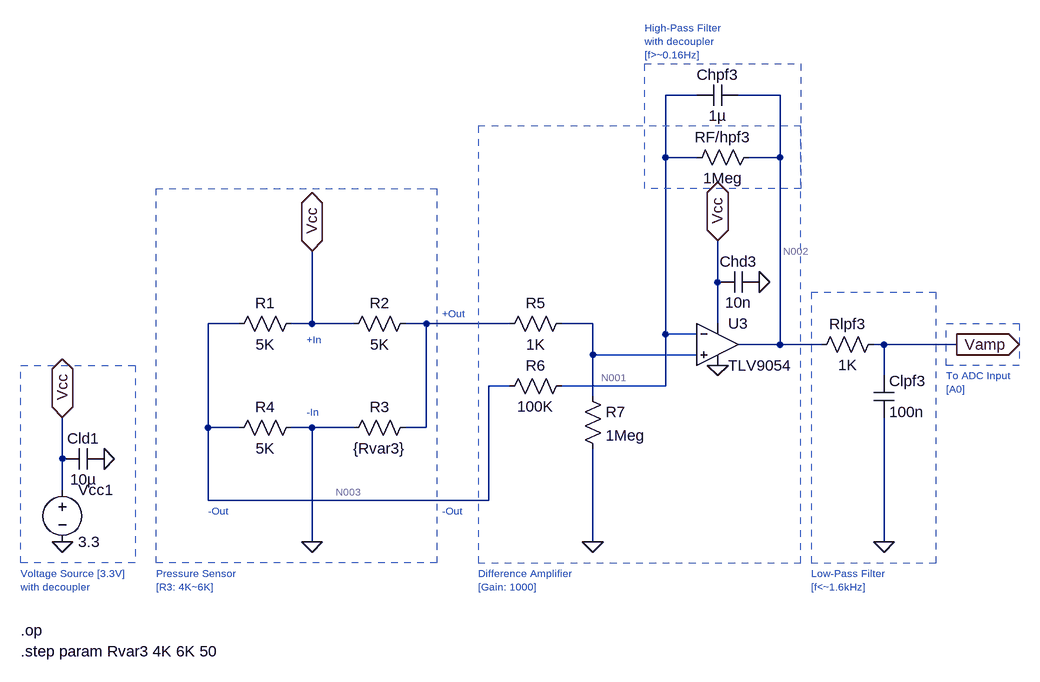
[diagram p0: schematic Project_3_PressureSensor.asc]
* Project_3_PressureSensor.asc
R1 Vcc N003 5K
R2 N004 Vcc 5K
R4 0 N003 5K
R3 N004 0 {Rvar3}
R5 N005 N004 1K
R6 N001 N003 100K
R7 N005 0 1Meg
RF/hpf3 N002 N001 1Meg
Chpf3 N002 N001 1µ
Chd3 Vcc 0 10n
* U3: TLV9054 (symbol TLV9054 not available, pins judged from their places): In+=N005 In-=N001 V+=Vcc V-=0 OUT=N002
Vcc1 Vcc 0 3.3
Cld1 0 Vcc 10µ
Rlpf3 Vamp N002 1K
Clpf3 Vamp 0 100n
* Pressure Sensor
* [R3: 4K~6K]
* Difference Amplifier
* [Gain: 1000]
* To ADC Input
* [A0]
* -Out
* -Out
* +Out
* Voltage Source [3.3V]
* with decoupler
* -In
* +In
* High-Pass Filter
* with decoupler
* [f>~0.16Hz]
.op
.step param Rvar3 4K 6K 50
* Low-Pass Filter
* [f<~1.6kHz]
.backanno
.end

* Results of the author's LTspice run, read from the files saved beside the schematic
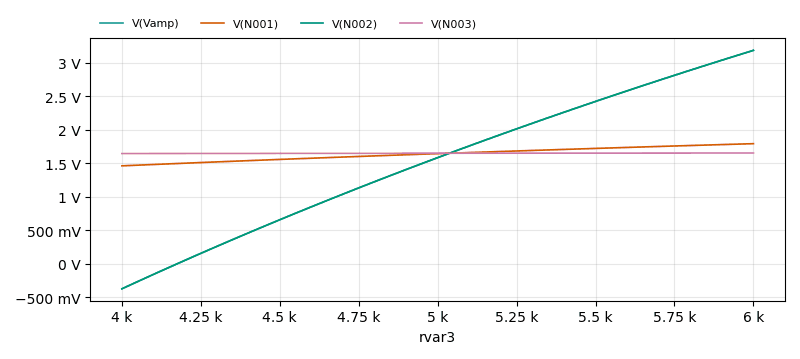
[diagram p1: Operating Point of Project_3_PressureSensor.asc, plotted from the saved traces]
* Operating Point, 1 run:
*   V(Vamp): -376.1 mV at rvar3=4 k, 3.188 V at rvar3=6 k, min -376.1 mV, max 3.188 V
*   V(N001): 1.462 V at rvar3=4 k, 1.793 V at rvar3=6 k, min 1.462 V, max 1.793 V
*   V(N002): -376.1 mV at rvar3=4 k, 3.188 V at rvar3=6 k, min -376.1 mV, max 3.188 V
*   V(N003): 1.645 V at rvar3=4 k, 1.653 V at rvar3=6 k, min 1.645 V, max 1.653 V